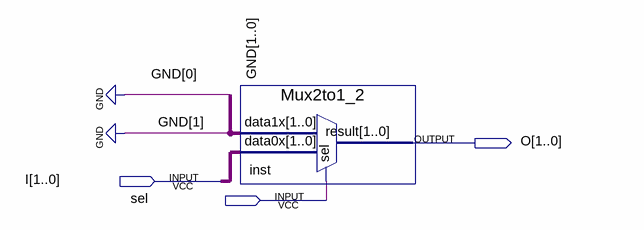
[diagram p0: schematic sheet]
// Quartus schematic FlushMux.bdf as structural Verilog: 1 symbols, 3 pins
module FlushMux (
  input  [1:0] I,
  input  sel,
  output [1:0] O
);

  Mux2to1_2 inst (.data1x(2'b00), .data0x(I), .sel(sel), .result(O));
endmodule
